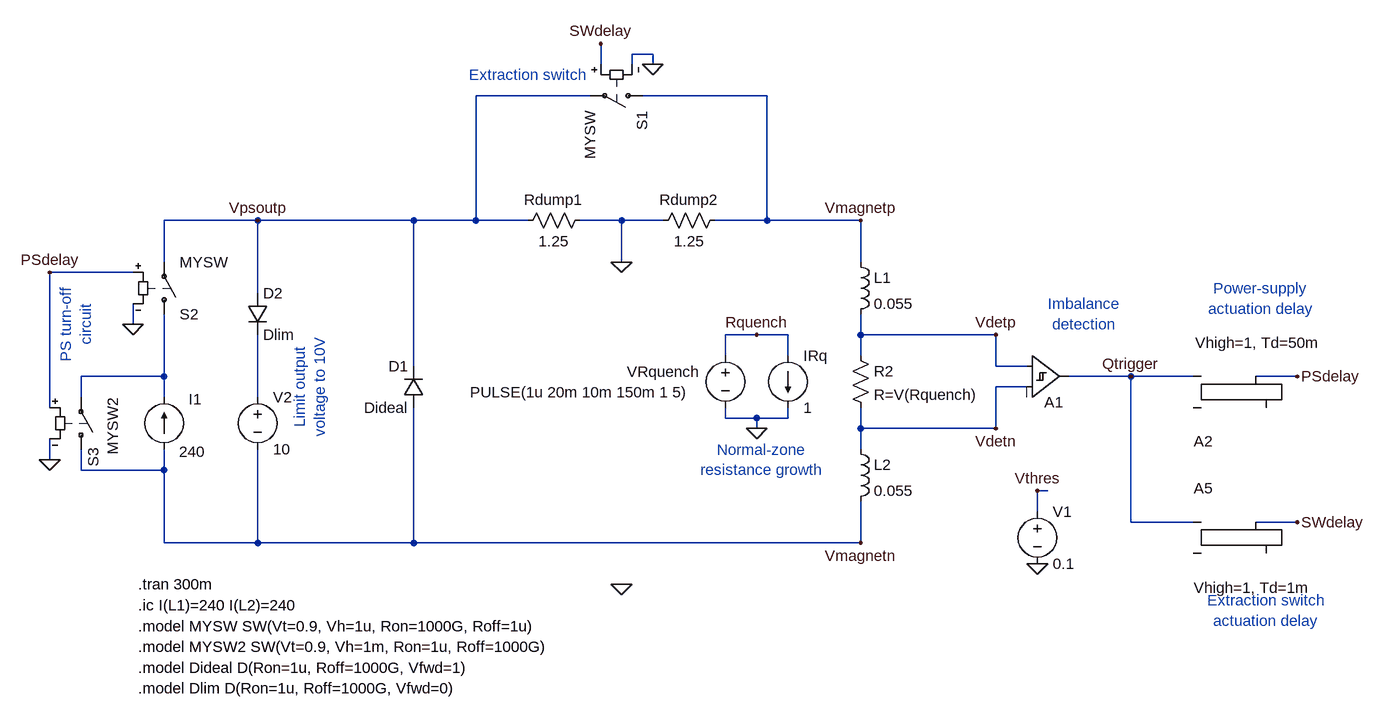
[diagram p0: schematic rdump_vout_lim.asc]
rdump_vout_lim.asc, the LTspice schematic file:
Version 4
SHEET 1 1512 1544
WIRE -16 -304 -48 -304
WIRE -96 -288 -96 -320
WIRE -48 -288 -48 -304
WIRE -16 -288 -16 -304
WIRE -112 -240 -288 -240
WIRE 160 -240 -32 -240
WIRE -624 -48 -768 -48
WIRE -384 -48 -624 -48
WIRE -288 -48 -288 -240
WIRE -288 -48 -384 -48
WIRE -208 -48 -288 -48
WIRE -64 -48 -128 -48
WIRE 0 -48 -64 -48
WIRE 160 -48 160 -240
WIRE 160 -48 80 -48
WIRE 304 -48 160 -48
WIRE -768 16 -768 -48
WIRE -64 16 -64 -48
WIRE 304 16 304 -48
WIRE -816 32 -944 32
WIRE -624 64 -624 -48
WIRE -816 112 -816 80
WIRE 144 128 96 128
WIRE 192 128 144 128
WIRE 304 128 304 96
WIRE 512 128 304 128
WIRE 96 160 96 128
WIRE 192 160 192 128
WIRE 304 160 304 128
WIRE -384 176 -384 -48
WIRE 512 176 512 128
WIRE 560 176 512 176
WIRE -768 192 -768 96
WIRE -768 192 -896 192
WIRE 720 192 624 192
WIRE 816 192 720 192
WIRE 976 192 912 192
WIRE 560 208 512 208
WIRE -896 224 -896 192
WIRE -768 224 -768 192
WIRE -624 224 -624 128
WIRE -944 240 -944 32
WIRE 96 256 96 240
WIRE 144 256 96 256
WIRE 192 256 192 240
WIRE 192 256 144 256
WIRE 144 272 144 256
WIRE 304 272 304 240
WIRE 512 272 512 208
WIRE 512 272 304 272
WIRE 304 304 304 272
WIRE -944 320 -944 288
WIRE -896 336 -896 304
WIRE -768 336 -768 304
WIRE -768 336 -896 336
WIRE 592 368 576 368
WIRE 576 400 576 368
WIRE 720 416 720 192
WIRE 816 416 720 416
WIRE 976 416 912 416
WIRE -768 448 -768 336
WIRE -624 448 -624 304
WIRE -624 448 -768 448
WIRE -384 448 -384 240
WIRE -384 448 -624 448
WIRE 304 448 304 384
WIRE 304 448 -384 448
FLAG 144 272 0
FLAG 144 128 Rquench
FLAG 976 192 PSdelay
FLAG 976 416 SWdelay
FLAG -16 -288 0
FLAG -816 112 0
FLAG -96 -320 SWdelay
FLAG -944 32 PSdelay
FLAG 720 192 Qtrigger
FLAG -944 320 0
FLAG -64 16 0
FLAG 512 128 Vdetp
FLAG 512 272 Vdetn
FLAG 576 480 0
FLAG 576 368 Vthres
FLAG 304 -48 Vmagnetp
FLAG 304 448 Vmagnetn
FLAG -624 -48 Vpsoutp
FLAG -64 512 0
SYMBOL ind 288 0 R0
SYMATTR InstName L1
SYMATTR Value 0.055
SYMATTR SpiceLine Rser=0 Rpar=0
SYMBOL res -224 -32 R270
WINDOW 0 32 56 VTop 2
WINDOW 3 0 56 VBottom 2
SYMATTR InstName Rdump1
SYMATTR Value 1.25
SYMBOL current -768 304 R180
WINDOW 0 -58 77 Left 2
WINDOW 3 -64 -4 Left 2
WINDOW 123 0 0 Left 0
WINDOW 39 0 0 Left 0
SYMATTR InstName I1
SYMATTR Value 240
SYMBOL sw -16 -240 R90
SYMATTR InstName S1
SYMATTR Value MYSW
SYMBOL sw -768 112 M180
SYMATTR InstName S2
SYMATTR Value MYSW
SYMBOL ind 288 288 R0
SYMATTR InstName L2
SYMATTR Value 0.055
SYMATTR SpiceLine Rser=0 Rpar=0
SYMBOL res 288 144 R0
SYMATTR InstName R2
SYMATTR Value R=V(Rquench)
SYMBOL voltage 96 144 R0
WINDOW 0 -152 41 Left 2
WINDOW 3 -393 72 Left 2
WINDOW 123 0 0 Left 0
WINDOW 39 0 0 Left 0
SYMATTR InstName VRquench
SYMATTR Value PULSE(1u 20m 10m 150m 1 5)
SYMBOL Digital\\diffschmtbuf 560 128 R0
WINDOW 0 27 104 Left 2
SYMATTR InstName A1
SYMATTR SpiceLine Vt=100m, Vh=1m, Vhigh=1, Vlow=0, Trise=1n, Tfall=1n
SYMBOL sw -896 320 M180
WINDOW 0 19 18 VLeft 2
WINDOW 3 49 95 VLeft 2
SYMATTR InstName S3
SYMATTR Value MYSW2
SYMBOL res -16 -32 R270
WINDOW 0 32 56 VTop 2
WINDOW 3 0 56 VBottom 2
SYMATTR InstName Rdump2
SYMATTR Value 1.25
SYMBOL diode -368 240 R180
WINDOW 0 24 64 Left 2
WINDOW 3 24 0 Left 2
SYMATTR InstName D1
SYMATTR Value Dideal
SYMBOL Digital\\srflop 864 144 R0
WINDOW 0 -47 148 Left 2
WINDOW 39 -45 -4 Left 2
SYMATTR InstName A2
SYMATTR SpiceLine Vhigh=1, Td=50m
SYMBOL Digital\\srflop 864 368 R0
WINDOW 0 -47 -4 Left 2
WINDOW 39 -47 149 Left 2
SYMATTR InstName A5
SYMATTR SpiceLine Vhigh=1, Td=1m
SYMBOL voltage 576 384 R0
WINDOW 123 0 0 Left 0
WINDOW 39 0 0 Left 0
SYMATTR InstName V1
SYMATTR Value 0.1
SYMBOL voltage -624 208 R0
WINDOW 123 0 0 Left 0
WINDOW 39 0 0 Left 0
SYMATTR InstName V2
SYMATTR Value 10
SYMBOL diode -640 64 R0
SYMATTR InstName D2
SYMATTR Value Dlim
SYMBOL current 192 160 R0
WINDOW 123 0 0 Left 0
WINDOW 39 0 0 Left 0
SYMATTR InstName IRq
SYMATTR Value 1
TEXT -808 512 Left 2 !.tran 300m
TEXT -808 544 Left 2 !.ic I(L1)=240 I(L2)=240
TEXT -808 576 Left 2 !.model MYSW SW(Vt=0.9, Vh=1u, Ron=1000G, Roff=1u)
TEXT -808 608 Left 2 !.model MYSW2 SW(Vt=0.9, Vh=1m, Ron=1u, Roff=1000G)
TEXT -808 640 Left 2 !.model Dideal D(Ron=1u, Roff=1000G, Vfwd=1)
TEXT -808 672 Left 2 !.model Dlim D(Ron=1u, Roff=1000G, Vfwd=0)
TEXT -544 208 VCenter 2 ;Limit output\nvoltage to 10V
TEXT -904 112 VCenter 2 ;PS turn-off\ncircuit
TEXT 648 96 Center 2 ;Imbalance\ndetection
TEXT 920 72 Center 2 ;Power-supply\nactuation delay
TEXT 928 552 Center 2 ;Extraction switch\nactuation delay
TEXT 152 320 Center 2 ;Normal-zone\nresistance growth
TEXT -208 -272 Center 2 ;Extraction switch

The netlist it stands for:
* rdump_vout_lim.asc
L1 Vmagnetp Vdetp 0.055 Rser=0 Rpar=0
Rdump1 Vpsoutp 0 1.25
I1 Vmagnetn N001 240
S1 Vmagnetp Vpsoutp SWdelay 0 MYSW
S2 N001 Vpsoutp PSdelay 0 MYSW
L2 Vdetn Vmagnetn 0.055 Rser=0 Rpar=0
R2 Vdetp Vdetn R=V(Rquench)
VRquench Rquench 0 PULSE(1u 20m 10m 150m 1 5)
A1 Vdetp Vdetn 0 0 0 0 Qtrigger 0 SCHMITT Vt=100m, Vh=1m, Vhigh=1, Vlow=0, Trise=1n, Tfall=1n
S3 Vmagnetn N001 PSdelay 0 MYSW2
Rdump2 0 Vmagnetp 1.25
D1 Vmagnetn Vpsoutp Dideal
A2 Qtrigger 0 0 0 0 0 PSdelay 0 SRFLOP Vhigh=1, Td=50m
A5 Qtrigger 0 0 0 0 0 SWdelay 0 SRFLOP Vhigh=1, Td=1m
V1 Vthres 0 0.1
V2 N002 Vmagnetn 10
D2 Vpsoutp N002 Dlim
IRq Rquench 0 1
.model D D
.lib standard.dio
.tran 300m
.ic I(L1)=240 I(L2)=240
.model MYSW SW(Vt=0.9, Vh=1u, Ron=1000G, Roff=1u)
.model MYSW2 SW(Vt=0.9, Vh=1m, Ron=1u, Roff=1000G)
.model Dideal D(Ron=1u, Roff=1000G, Vfwd=1)
.model Dlim D(Ron=1u, Roff=1000G, Vfwd=0)
* Limit output
* voltage to 10V
* PS turn-off
* circuit
* Imbalance
* detection
* Power-supply
* actuation delay
* Extraction switch
* actuation delay
* Normal-zone
* resistance growth
* Extraction switch
.backanno
.end